# Altium schematic sheet Boost_LM5123.SchDoc: Mynd-Boost
size A3; PageSetup: Record=PageOptions|CenterHorizontal=True|CenterVertical=True|PrintScale=0.71|XCorrection=1.00|YCorrection=1.00|PrintKind=0|BorderSize=5000000|LeftOffset=0|BottomOffset=0|Orientation=2|PaperLength=1000|PaperWidth=1000|Scale=100|PaperSource=7|PrintQuality=-3|MediaType=1|DitherType=10|PrintScaleMode=1|PaperKind=A4|PaperIndex=9; SheetNumber: 6; SheetTotal: 6
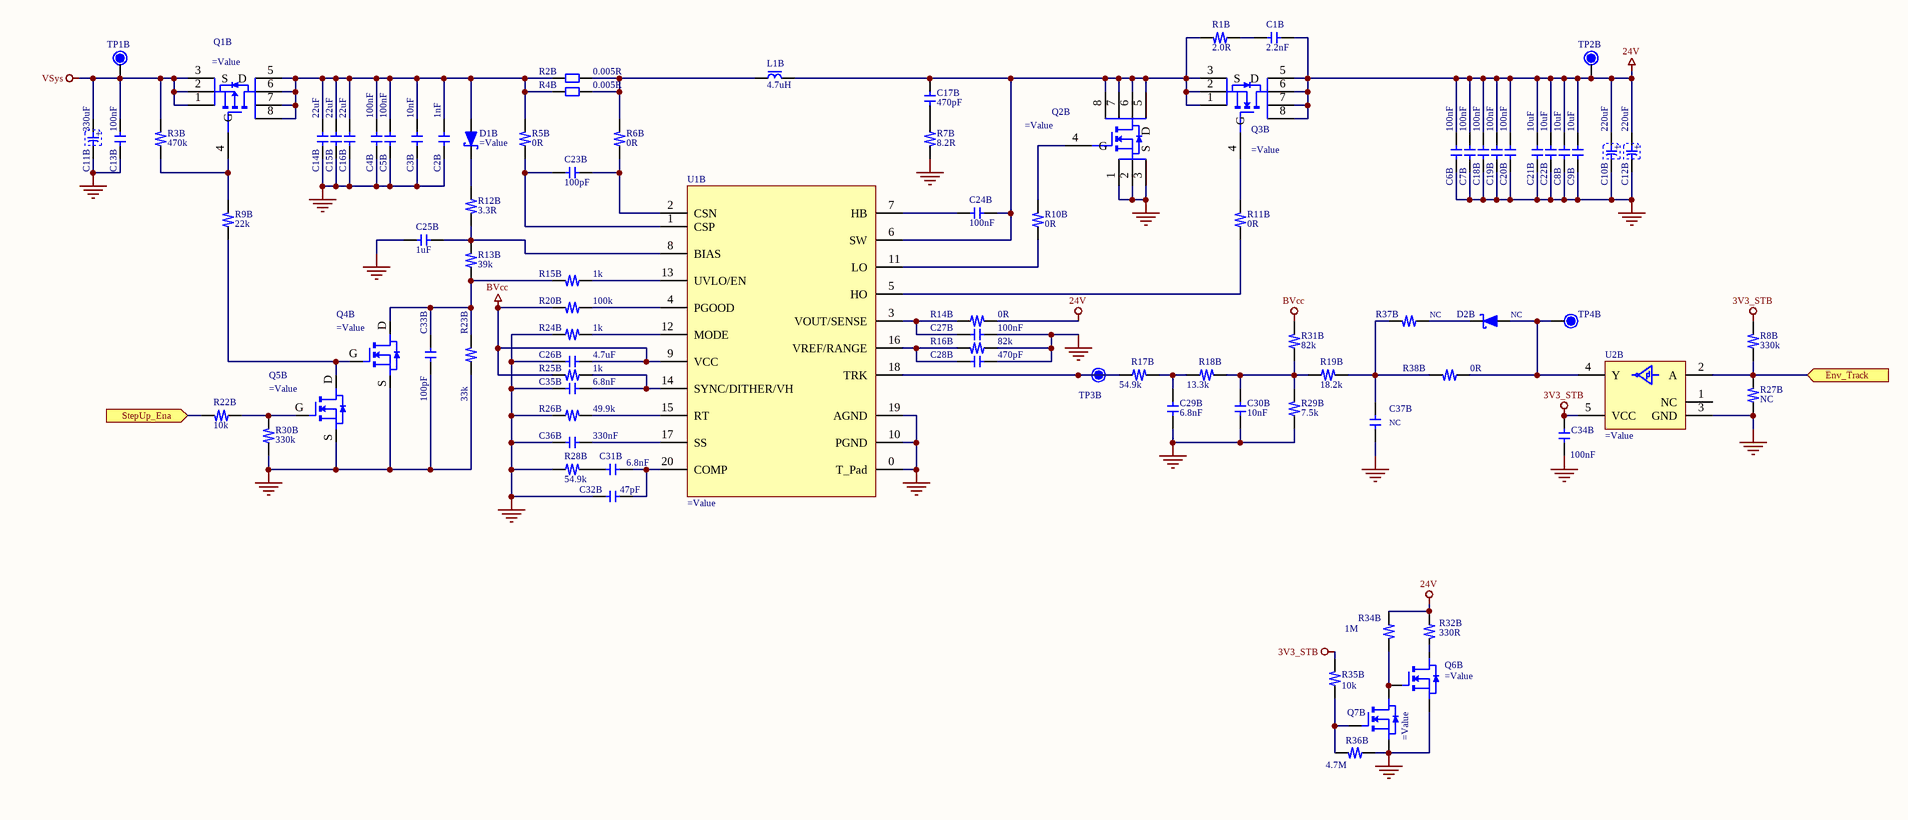
[diagram p0: Boost_LM5123.SchDoc]

## Parts
C1B  2.2nF  [C0603X100]
C2B  1nF  [C0603X100]
C3B  10nF  [C0603X100]
C4B  100nF  [C0603X100]
C5B  100nF  [C0603X100]
C6B  100nF  [C0603X100]
C7B  100nF  [C0603X100]
C8B  10uF  [C1206]
C9B  10uF  [C1206]
C10B  220uF  [ECAP_SMD_800X1000]
C11B  330uF  [E_CAP_SMD_10%2A10.2]
C12B  220uF  [ECAP_SMD_800X1000]
C13B  100nF  [C0603X100]
C14B  22uF  [C1206]
C15B  22uF  [C1206]
C16B  22uF  [C1206]
C17B  470pF  [C0603X80]
C18B  100nF  [C0603X100]
C19B  100nF  [C0603X100]
C20B  100nF  [C0603X100]
C21B  10uF  [C1206]
C22B  10uF  [C1206]
C23B  100pF  [C0603X80]
C24B  100nF  [C0603X100]
C25B  1uF  [C0603X105]
C26B  4.7uF  [C0805_145]
C27B  100nF  [C0603X100]
C28B  470pF  [C0603X80]
C29B  6.8nF  [C0603X100]
C30B  10nF  [C0603X100]
C31B  6.8nF  [C0603X100]
C32B  47pF  [C0603X80]
C33B  100pF  [C0603X80]
C34B  100nF  [C0603X100]
C35B  6.8nF  [C0603X100]
C36B  330nF  [C0603X105]
C37B  1uF  [C0603X105]  (value not drawn)
D1B  (no value)  [SOD-123]
D2B  (no value)  [SOD-323]
L1B  4.7uH  [IND_SMD_YT_SQU_L135XW126XH57]
Q1B  (no value)  [DFN8_500X600X100_127_A]
Q2B  (no value)  [DFN8_500X600X100_127_A]
Q3B  (no value)  [DFN8_500X600X100_127_A]
Q4B  (no value)  [SOT23-GSD]
Q5B  (no value)  [SOT23-GSD]
Q6B  (no value)  [SOT23-GSD]
Q7B  (no value)  [SOT23-GSD]
R1B  2.0R  [R0805]
R2B  0.005R  [R1206]
R3B  470k  [R0603]
R4B  0.005R  [R1206]
R5B  0R  [R0603]
R6B  0R  [R0603]
R7B  8.2R  [R0805]
R8B  330k  [R0603]
R9B  22k  [R0603]
R10B  0R  [R0603]
R11B  0R  [R0603]
R12B  3.3R  [R0603]
R13B  39k  [R0603]
R14B  0R  [R0603]
R15B  1k  [R0603]
R16B  82k  [R0603]
R17B  54.9k  [R0603]
R18B  13.3k  [R0603]
R19B  18.2k  [R0603]
R20B  100k  [R0603]
R22B  10k  [R0603]
R23B  33k  [R0603]
R24B  1k  [R0603]
R25B  1k  [R0603]
R26B  49.9k  [R0603]
R27B  NC  [R0603]
R28B  54.9k  [R0603]
R29B  7.5k  [R0603]
R30B  330k  [R0603]
R31B  82k  [R0603]
R32B  330R  [R1206]
R34B  1M  [R0603]
R35B  10k  [R0603]
R36B  4.7M  [R0603]
R37B  180R  [R0603]  (value not drawn)
R38B  0R  [R0603]
TP1B  TP_T_60_40  [TP_T_60_40]  (value not drawn)  (no BOM)
TP2B  TP_T_60_40  [TP_T_60_40]  (value not drawn)  (no BOM)
TP3B  TP_T_60_40  [TP_T_60_40]  (value not drawn)  (no BOM)
TP4B  TP_T_60_40  [TP_T_60_40]  (value not drawn)  (no BOM)
U1B  (no value)  [QFN20_350X350X100_50_P200X200]
U2B  (no value)  [SOT23-5]

## Ports
Env_Track (in), StepUp_Ena (in)

## Nets
3V3_STB: C34B.2 R8B.1 R35B.1 U2B.5(VCC)
24V: C1B.1 C6B.2 C7B.2 C8B.2 C9B.2 C10B.1 C12B.1 C18B.2 C19B.2 C20B.2 C21B.2 C22B.2 Q3B.5(D) Q3B.6(D) Q3B.7(D) Q3B.8(D) R14B.1 R32B.2 R34B.2 TP2B.1
BVcc: C26B.1 R20B.1 R25B.1 R31B.1 U1B.9(VCC)
GND: C2B.1 C3B.1 C4B.2 C5B.2 C6B.1 C7B.1 C8B.1 C9B.1 C10B.2 C11B.2 C12B.2 C13B.1 C14B.1 C15B.1 C16B.1 C18B.1 C19B.1 C20B.1 C21B.1 C22B.1 C25B.2 C26B.2 C27B.2 C28B.2 C29B.2 C30B.2 C32B.2 C33B.2 C34B.1 C35B.2 C36B.2 C37B.1 Q2B.1(S) Q2B.2(S) Q2B.3(S) Q4B.S Q5B.S Q6B.S Q7B.S R7B.1 R16B.2 R23B.2 R24B.2 R26B.2 R27B.2 R28B.2 R29B.2 R30B.2 R36B.2 U1B.0(T_Pad) U1B.10(PGND) U1B.19(AGND) U2B.3(GND)
VSys: C11B.1 C13B.2 Q1B.1(S) Q1B.2(S) Q1B.3(S) R3B.1 TP1B.1
Env_Track: R8B.2 R27B.1 U2B.2(A) ; port Env_Track
StepUp_Ena: R22B.1 ; port StepUp_Ena
NetC1B_2: C1B.2 R1B.2
NetC2B_2: C2B.2 C3B.2 C4B.1 C5B.1 C14B.2 C15B.2 C16B.2 D1B.A Q1B.5(D) Q1B.6(D) Q1B.7(D) Q1B.8(D) R2B.1 R4B.1 R5B.1
NetC17B_1: C17B.1 C24B.1 L1B.2 Q2B.5(D) Q2B.6(D) Q2B.7(D) Q2B.8(D) Q3B.1(S) Q3B.2(S) Q3B.3(S) R1B.1 U1B.6(SW)
NetC17B_2: C17B.2 R7B.2
NetC23B_1: C23B.1 R5B.2 U1B.1(CSP)
NetC23B_2: C23B.2 R6B.2 U1B.2(CSN)
NetC24B_2: C24B.2 U1B.7(HB)
NetC25B_1: C25B.1 R12B.1 R13B.1 U1B.8(BIAS)
NetC27B_1: C27B.1 R14B.2 U1B.3(VOUT/SENSE)
NetC28B_1: C28B.1 R16B.1 U1B.16(VREF/RANGE)
NetC29B_1: C29B.1 R17B.1 R18B.2
NetC30B_1: C30B.1 R18B.1 R19B.2 R29B.1 R31B.2
NetC31B_1: C31B.1 R28B.1
NetC31B_2: C31B.2 C32B.1 U1B.20(COMP)
NetC33B_1: C33B.1 Q4B.D R13B.2 R15B.1 R23B.1
NetC35B_1: C35B.1 R25B.2 U1B.14(SYNC/DITHER/VH)
NetC36B_1: C36B.1 U1B.17(SS)
NetC37B_2: C37B.2 R19B.1 R37B.1 R38B.1
NetD1B_K: D1B.K R12B.2
NetD2B_A: D2B.A R38B.2 TP4B.1 U2B.4(Y)
NetD2B_K: D2B.K R37B.2
NetL1B_1: L1B.1 R2B.2 R4B.2 R6B.1
NetQ1B_4: Q1B.4(G) R3B.2 R9B.1
NetQ2B_4: Q2B.4(G) R10B.2
NetQ3B_4: Q3B.4(G) R11B.2
NetQ4B_G: Q4B.G Q5B.D R9B.2
NetQ5B_G: Q5B.G R22B.2 R30B.1
NetQ6B_D: Q6B.D R32B.1
NetQ6B_G: Q6B.G Q7B.D R34B.1
NetQ7B_G: Q7B.G R35B.2 R36B.1
NetR10B_1: R10B.1 U1B.11(LO)
NetR11B_1: R11B.1 U1B.5(HO)
NetR15B_2: R15B.2 U1B.13(UVLO/EN)
NetR17B_2: R17B.2 TP3B.1 U1B.18(TRK)
NetR20B_2: R20B.2 U1B.4(PGOOD)
NetR24B_1: R24B.1 U1B.12(MODE)
NetR26B_1: R26B.1 U1B.15(RT)

Not connected (* = marked no-connect by the designer): U2B 1(NC)

## Notes on the sheet
- (near R37B) NC
- (near D2B) NC
- (near C37B) NC
- Revision:
- Lautspreecher Teufel GmbH
- Budapester Straße 44
- 10787 Berlin
- Germany
- Page Title:
- Engineer:
- Project:
- Version:
- Rev:
- modified:
- Date:
- Size:
- A3
- File Name:
- Page:
- of
- (in symbol P-001-0735-6) +
- (in symbol P-001-0775-3) +

## Library data of the parts
C1B = P-001-0080-19: PSHF SMD M CAP 2.2nF 50V ±10% 0603 X7R; Manufacturer: Multi Sourced; Part_Number: Generic; Part_Type: Capacitor ceramic SMT; Tolerance: ±10%; TemperatureRange: X7R; Value: 2.2nF; Temp_Coefficient: X7R; Voltage: 50V
C2B = P-001-0073-48: PSHF SMD M CAP 1nF 50V ±10% 0603 X7R; Manufacturer: Multi Sourced; Part_Number: Generic; Part_Type: Capacitor ceramic SMT; Tolerance: ±10%; TemperatureRange: X7R; Value: 1nF; Temp_Coefficient: X7R; Voltage: 50V
C3B C30B = P-001-0058-45: PSHF SMD M CAP 10nF 50V ±10% 0603 X7R; Manufacturer: Multi Sourced; Part_Number: Generic; Part_Type: Capacitor ceramic SMT; Tolerance: ±10%; TemperatureRange: X7R; Value: 10nF; Temp_Coefficient: X7R; Voltage: 50V
C4B C5B C13B C34B = P-001-0035-28: PSHF SMD M CAP 100nF 25V ±10% 0603 X7R; Manufacturer: Multi Sourced; Part_Number: Generic; Part_Type: Capacitor ceramic SMT; Tolerance: ±10%; TemperatureRange: X7R; Value: 100nF; Temp_Coefficient: X7R; Voltage: 25V
C6B C7B C18B C19B C20B = P-001-0074-61: PSHF SMD M CAP 100nF 50V ±10% 0603 X7R; Manufacturer: Multi Sourced; Part_Number: Generic; Part_Type: Capacitor ceramic SMT; Tolerance: ±10%; TemperatureRange: X7R; Value: 100nF; Temp_Coefficient: X7R; Voltage: 50V
C8B C9B C21B C22B = P-001-0200-18: PSHF SMD M CAP 10uF 50V ±10% 1206 X5R; Manufacturer: Multi Sourced; Part_Number: Generic; Part_Type: Capacitor ceramic SMT; Tolerance: ±10%; TemperatureRange: X5R; Value: 10uF; Temp_Coefficient: X5R; Voltage: 50V
C10B C12B = P-001-0775-3: SMD COND ELECT 220μF 35V ±20% 105°C SHOUKE; Manufacturer: Multi-Sourced; Part_Number: Generic; Part_Type: Capacitor electrolytic SMT; Tolerance: ±20%; TemperatureRange: 105°C; Value: 220uF; Voltage: 35V
C11B = P-001-0735-6: GPHF SMD COND ELECT 330μF 35V ±20% -40-+105℃ 10x10.5mm; Manufacturer: Multi-Sourced; Part_Number: Generic; Part_Type: Capacitor electrolytic SMT; Tolerance: ±20%; TemperatureRange: -40-+105℃; Value: 330uF; Voltage: 35V
C14B C15B C16B = P-001-0195-15: PSHF SMD M CAP 22uF 25V ±20% 1206 X5R; Manufacturer: Multi Sourced; Part_Number: Generic; Part_Type: Capacitor ceramic SMT; Tolerance: ±20%; TemperatureRange: X5R; Value: 22uF; Temp_Coefficient: X5R; Voltage: 25V
C17B C28B = P-001-0393-16: PSHF SMD M CAP 470pF 50V ±5% 0603 NPO; Manufacturer: Multi Sourced; Part_Number: Generic; Part_Type: Capacitor ceramic SMT; Tolerance: ±5%; TemperatureRange: NPO; Value: 470pF; Temp_Coefficient: NPO; Voltage: 50V
C23B C33B = P-001-0637-10: PSHF SMD M CAP 100pF 50V ±10% 0603 X7R; Manufacturer: Multi Sourced; Part_Number: Generic; Part_Type: Capacitor ceramic SMT; Tolerance: ±10%; TemperatureRange: X7R; Value: 100pF; Temp_Coefficient: X7R; Voltage: 50V
C24B C27B = P-001-0074-64: GPHF SMD M CAP 100nF 50V ±10% 0603 X7R; Manufacturer: Multi Sourced; Part_Number: Generic; Part_Type: Capacitor ceramic SMT; Tolerance: ±10%; TemperatureRange: X7R; Value: 100nF; Temp_Coefficient: X7R; Voltage: 50V
C25B = P-001-0029-20: PSHF SMD M CAP 1uF 25V ±10% 0603 X7R; Manufacturer: Multi Sourced; Part_Number: Generic; Part_Type: Capacitor ceramic SMT; Tolerance: ±10%; TemperatureRange: X7R; Value: 1uF; Temp_Coefficient: X7R; Voltage: 25V
C26B = P-001-0169-16: PSHF SMD M CAP 4.7uF 25V ±10% 0805 X7R; Manufacturer: Multi Sourced; Part_Number: Generic; Part_Type: Capacitor ceramic SMT; Tolerance: ±10%; TemperatureRange: X7R; Value: 4.7uF; Temp_Coefficient: X7R; Voltage: 25V
C29B C31B C35B = P-001-0103-25: PSHF SMD M CAP 6.8nF 50V ±10% 0603 X7R; Manufacturer: Multi Sourced; Part_Number: Generic; Part_Type: Capacitor ceramic SMT; Tolerance: ±10%; TemperatureRange: X7R; Value: 6.8nF; Temp_Coefficient: X7R; Voltage: 50V
C32B = P-001-0386-16: PSHF SMD M CAP 47pF 50V ±5% 0603 NPO; Manufacturer: Multi Sourced; Part_Number: Generic; Part_Type: Capacitor ceramic SMT; Tolerance: ±5%; TemperatureRange: NPO; Value: 47pF; Temp_Coefficient: NPO; Voltage: 50V
C36B = P-001-0769-2: SMD M CAP 330nF 50V ±10% 0603 X7R; Manufacturer: Multi Sourced; Part_Number: Generic; Part_Type: Capacitor ceramic SMT; Tolerance: ±10%; TemperatureRange: X7R; Value: 330nF; Temp_Coefficient: X7R; Voltage: 50V
C37B = P-001-0034-20: GPHF SMD M CAP 1uF 10V ±10% 0603 X7R; Manufacturer: Multi Sourced; Part_Number: Generic; Part_Type: Capacitor ceramic SMT; Tolerance: ±10%; TemperatureRange: X7R; Value: 1uF; Temp_Coefficient: X7R; Voltage: 10V
D1B = R-001-0072-13: PS SMD DIODE 2P SOD-123 B5819W CJ; Manufacturer: [CJ]; Part_Type: Semiconductor Diode SMT; Current: 1A; Voltage: 40V; Value: B5819W; Part_Number: B5819W
D2B = R-001-0029-31: GP SMD DIODE 2P 30V SOD323 BAT54WS PANJIT; Part_Type: Semiconductor Diode SMT; Current: 0.2A; Manufacturer: PANJIT; Voltage: 30V; Value: BAT54WS; Part_Number: BAT54WS
L1B = S-001-0418-2: SMD INDUCTOR 4.7μH 100KHz NORM; Manufacturer: CET CHAMPI; Part_Number: CET1265H-4R7M-P; Part_Type: Inductor SMT; Current: 14A; Tolerance: 7:20%; Frequency: 100KHz; Value: 4.7uH
Q1B = R-001-1701-2: SMD FET 8P 30V PDFN5x6-8L JMTG080P03A JJW; Part_Type: Semiconductor Transistor SMT; Current: 50A; Voltage: 30; Manufacturer: JJW; Value: JMTG080P03A; Part_Number: JMTG080P03A
Q2B Q3B = R-001-1702-2: SMD FET 8P 40V PDFN5x6-8L JMTG60N04B JJW; Part_Type: Semiconductor Transistor SMT; Current: 50A; Voltage: 40; Manufacturer: JJW; Value: JMTG60N04B; Part_Number: JMTG60N04B
Q4B Q5B Q6B Q7B = R-001-0217-29: GP SMD FET 3P SOT23 2N7002K CTE; Part_Type: Semiconductor Transistor SMT; Current: 300MA; Voltage: 60V; Manufacturer: CTE; Value: 2N7002K; Part_Number: 2N7002K
R1B = Q-001-0668-17: PS SMD RES. 2OHM 1/8W 5% 0805; Part_Type: Resistor SMT; Manufacturer: Multi-Sourced; Part_Number: Generic; Tolerance: 1%; Temp_Coefficient: 150ppm; Value: 2.0R; Wattage: 1/8W
R2B R4B = Q-001-0993-2: SMD METAL FILM RES. 5mohm 1W 1% 1206 WALTER; Part_Number: STE1206M1W0R005FS; Part_Type: Resistor SMT; Temp_Coefficient: 150ppm; Tolerance: 1%; Manufacturer: WALTER; Wattage: 1W; Value: 0.005R
R3B = Q-001-0432-19: PS SMD RES. 470KOHM 1/10W 1% 0603; Part_Type: Resistor SMT; Manufacturer: Multi-Sourced; Part_Number: Generic; Temp_Coefficient: 150ppm; Tolerance: 1%; Value: 470k; Wattage: 1/10W
R5B R6B R10B R11B R14B = Q-001-0048-199: PS SMD RES. 0OHM 1/10W 5% 0603; Part_Type: Resistor SMT; Manufacturer: Multi-Sourced; Part_Number: Generic; Tolerance: 1%; Temp_Coefficient: 150ppm; Value: 0R; Wattage: 1/10W
R7B = Q-001-0992-2: SMD RES. 8.2Ohm 1/8W 1% 0805; Part_Type: Resistor SMT; Manufacturer: Multi-Sourced; Part_Number: Generic; Temp_Coefficient: 150ppm; Tolerance: 1%; Value: 8.2R; Wattage: 1/8W
R8B R30B = Q-001-0378-19: PS SMD RES. 330KOHM 1/10W 1% 0603; Part_Type: Resistor SMT; Manufacturer: Multi-Sourced; Part_Number: Generic; Temp_Coefficient: 150ppm; Tolerance: 1%; Value: 330k; Wattage: 1/10W
R9B = Q-001-0372-31: PS SMD RES. 22KOHM 1/10W 1% 0603; Part_Type: Resistor SMT; Manufacturer: Multi-Sourced; Part_Number: Generic; Temp_Coefficient: 150ppm; Tolerance: 1%; Value: 22k; Wattage: 1/10W
R12B = Q-001-0403-21: PS SMD RES. 3.3OHM 1/10W 1% 0603; Part_Type: Resistor SMT; Manufacturer: Multi-Sourced; Part_Number: Generic; Temp_Coefficient: 150ppm; Tolerance: 1%; Value: 3.3R; Wattage: 1/10W
R13B = Q-001-0430-26: PS SMD RES. 39KOHM 1/10W 1% 0603; Part_Type: Resistor SMT; Manufacturer: Multi-Sourced; Part_Number: Generic; Temp_Coefficient: 150ppm; Tolerance: 1%; Value: 39k; Wattage: 1/10W
R15B R25B = Q-001-0033-26: PS SMD RES. 1KOHM 1/10W 1% 0603; Part_Type: Resistor SMT; Manufacturer: Multi-Sourced; Part_Number: Generic; Temp_Coefficient: 150ppm; Tolerance: 1%; Value: 1k; Wattage: 1/10W
R16B = Q-001-0026-23: PS SMD RES. 82KOHM 1/10W 1% 0603; Part_Type: Resistor SMT; Manufacturer: Multi-Sourced; Part_Number: Generic; Tolerance: 5%; Temp_Coefficient: 150ppm; Value: 82k; Wattage: 1/10W
R17B = Q-001-0991-2: SMD RES. 54.9KOhm 1/10W 1% 0603; Part_Type: Resistor SMT; Manufacturer: Multi-Sourced; Part_Number: Generic; Tolerance: 5%; Temp_Coefficient: 150ppm; Value: 54.9k; Wattage: 1/10W
R18B = Q-001-0312-25: PS SMD RES. 13.3KOHM 1/10W 1% 0603; Part_Type: Resistor SMT; Manufacturer: Multi-Sourced; Part_Number: Generic; Tolerance: 5%; Temp_Coefficient: 150ppm; Value: 13.3k; Wattage: 1/10W
R19B = Q-001-0687-23: GPHF SMD RES. 18.2KOHM 1/10W 1% 0603; Manufacturer: Multi-Sourced; Part_Number: Generic; Part_Type: Resistor SMT; Temp_Coefficient: 150ppm; Tolerance: 1%; Wattage: 1/10W; Value: 18.2k
R20B = Q-001-0032-53: PS SMD RES. 100KOHM 1/10W 1% 0603; Part_Type: Resistor SMT; Manufacturer: Multi-Sourced; Part_Number: Generic; Temp_Coefficient: 150ppm; Tolerance: 1%; Value: 100k; Wattage: 1/10W
R22B R35B = Q-001-0036-48: PS SMD RES. 10KOHM 1/10W 1% 0603; Part_Type: Resistor SMT; Manufacturer: Multi-Sourced; Part_Number: Generic; Temp_Coefficient: 150ppm; Tolerance: 1%; Value: 10k; Wattage: 1/10W
R23B = Q-001-0388-42: PS SMD RES. 33KOHM 1/10W 1% 0603; Part_Type: Resistor SMT; Manufacturer: Multi-Sourced; Part_Number: Generic; Temp_Coefficient: 150ppm; Tolerance: 1%; Value: 33k; Wattage: 1/10W
R24B = Q-001-0033-26: PS SMD RES. 1KOHM 1/10W 1% 0603; Manufacturer: Multi-Sourced; Part_Number: Generic; Part_Type: Resistor SMT; Temp_Coefficient: 150ppm; Tolerance: 1%; Wattage: 1/10W; Value: 1k
R26B = Q-001-0003-18: PS SMD RES. 49.9KOHM 1/10W 1% 0603; Part_Type: Resistor SMT; Manufacturer: Multi-Sourced; Part_Number: Generic; Temp_Coefficient: 150ppm; Tolerance: 1%; Value: 49.9k; Wattage: 1/10W
R27B = Q-001-0032-53: PS SMD RES. 100KOHM 1/10W 1% 0603; Manufacturer: Multi-Sourced; Part_Number: Generic; Part_Type: Resistor SMT; Temp_Coefficient: 150ppm; Tolerance: 1%; Wattage: 1/10W; Value: NC
R28B = Q-001-0991-2: SMD RES. 54.9KOhm 1/10W 1% 0603; Part_Type: Resistor SMT; Manufacturer: Multi-Sourced; Part_Number: Generic; Temp_Coefficient: 150ppm; Tolerance: 1%; Value: 54.9k; Wattage: 1/10W
R29B = Q-001-0041-24: GPHF SMD RES. 7.5KOHM 1/10W 1% 0603; Manufacturer: Multi-Sourced; Part_Number: Generic; Part_Type: Resistor SMT; Temp_Coefficient: 150ppm; Tolerance: 1%; Wattage: 1/10W; Value: 7.5k
R31B = Q-001-0026-26: GPHF SMD RES. 82KOHM 1/10W 1% 0603; Manufacturer: Multi-Sourced; Part_Number: Generic; Part_Type: Resistor SMT; Temp_Coefficient: 150ppm; Tolerance: 1%; Wattage: 1/10W; Value: 82k
R32B = Q-001-0577-19: PS SMD RES. 330OHM 1/4W 5% 1206; Manufacturer: Multi-Sourced; Part_Number: Generic; Part_Type: Resistor SMT; Temp_Coefficient: 150ppm; Tolerance: 5%; Wattage: 1/4W; Value: 330R
R34B = Q-001-0062-23: PS SMD RES. 1MOHM 1/10W 5% 0603; Manufacturer: Multi-Sourced; Part_Number: Generic; Part_Type: Resistor SMT; Temp_Coefficient: 150ppm; Tolerance: 5%; Wattage: 1/10W; Value: 1M
R36B = Q-001-0091-19: PS SMD RES. 4.7MOHM 1/10W 5% 0603; Manufacturer: Multi-Sourced; Part_Number: Generic; Part_Type: Resistor SMT; Temp_Coefficient: 150ppm; Tolerance: 5%; Wattage: 1/10W; Value: 4.7M
R37B = Q-001-0202-22: GPHF SMD RES. 180OHM 1/10W 5% 0603; Manufacturer: Multi-Sourced; Part_Number: Generic; Part_Type: Resistor SMT; Temp_Coefficient: 150ppm; Wattage: 1/10W; Tolerance: 5%; Value: 180R
R38B = Q-001-0048-204: GPHF SMD RES. 0OHM 1/10W 5% 0603; Manufacturer: Multi-Sourced; Part_Number: Generic; Part_Type: Resistor SMT; Temp_Coefficient: 150ppm; Wattage: 1/10W; Tolerance: 5%; Value: 0R
TP1B TP2B TP3B TP4B = CMP-00089-1: Test Point; Design Item ID: TP
U1B = R-001-1799-2: SMD IC 20P VQFN LM51231QRGRRQ1 TI; Part_Type: Semiconductor Integrated Circuit SMT; Manufacturer: TI; Part_Number: LM51231QRGRRQ1; Value: LM51231QRGRRQ1
U2B = R-001-0727-13: GP SMD IC 5P SOT23 SGM7SZ14YN5G/TR SGMICRO; Manufacturer: [SGMICRO]; Part_Type: Semiconductor Integrated Circuit SMT; Part_Number: SGM7SZ14YN5G/TR; Value: SGM7SZ14YN5G/TR